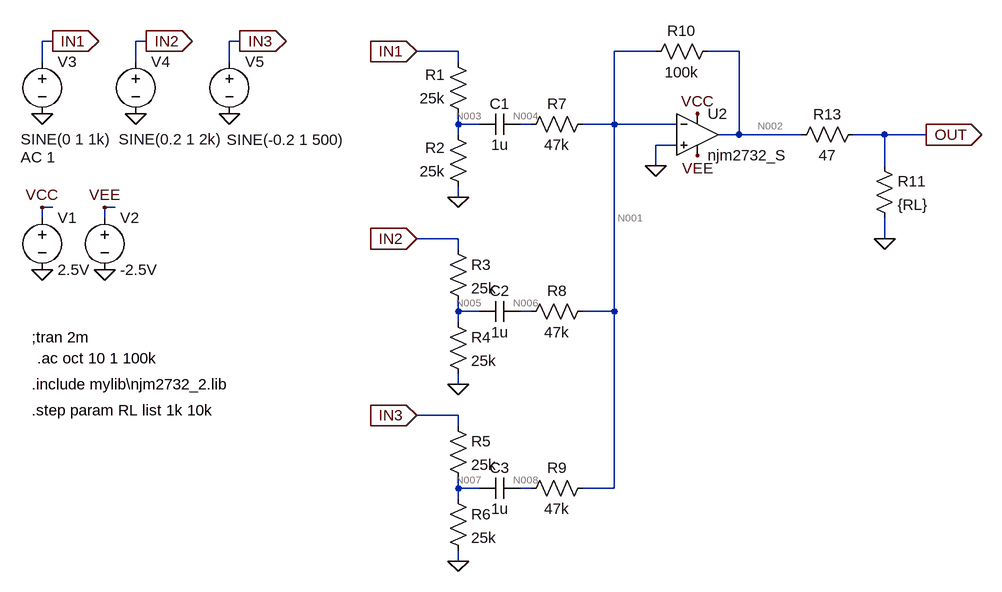
[diagram p0: schematic mini_mixer-04.asc]
mini_mixer-04.asc, the LTspice schematic file:
Version 4
SHEET 1 996 840
WIRE -656 0 -672 0
WIRE -512 0 -528 0
WIRE -368 0 -384 0
WIRE -32 16 -96 16
WIRE 272 16 208 16
WIRE 400 16 352 16
WIRE -672 32 -672 0
WIRE -528 32 -528 0
WIRE -384 32 -384 0
WIRE -32 32 -32 16
WIRE -32 128 -32 112
WIRE 0 128 -32 128
WIRE 80 128 64 128
WIRE 208 128 208 16
WIRE 208 128 160 128
WIRE 304 128 208 128
WIRE -32 144 -32 128
WIRE 400 144 400 16
WIRE 400 144 368 144
WIRE 496 144 400 144
WIRE 624 144 576 144
WIRE 688 144 624 144
WIRE 304 160 272 160
WIRE 272 192 272 160
WIRE 624 192 624 144
WIRE -32 240 -32 224
WIRE -656 256 -672 256
WIRE -560 256 -576 256
WIRE -672 272 -672 256
WIRE -576 272 -576 256
WIRE -32 304 -96 304
WIRE 624 304 624 272
WIRE -32 320 -32 304
WIRE -32 416 -32 400
WIRE 0 416 -32 416
WIRE 80 416 64 416
WIRE 208 416 208 128
WIRE 208 416 160 416
WIRE -32 432 -32 416
WIRE -32 528 -32 512
WIRE -32 576 -96 576
WIRE -32 592 -32 576
WIRE -32 688 -32 672
WIRE 0 688 -32 688
WIRE 80 688 64 688
WIRE 208 688 208 416
WIRE 208 688 160 688
WIRE -32 704 -32 688
WIRE -32 800 -32 784
FLAG -96 16 IN1
IOPIN -96 16 In
FLAG -96 304 IN2
IOPIN -96 304 In
FLAG -96 576 IN3
IOPIN -96 576 In
FLAG -32 240 0
FLAG -32 528 0
FLAG -32 800 0
FLAG 272 192 0
FLAG 688 144 OUT
IOPIN 688 144 Out
FLAG 336 112 VCC
FLAG 336 176 VEE
FLAG -672 352 0
FLAG -576 352 0
FLAG -672 256 VCC
FLAG -576 256 VEE
FLAG -656 0 IN1
IOPIN -656 0 Out
FLAG -512 0 IN2
IOPIN -512 0 Out
FLAG -368 0 IN3
IOPIN -368 0 Out
FLAG -672 112 0
FLAG -528 112 0
FLAG -384 112 0
FLAG 624 304 0
SYMBOL res -16 128 R180
WINDOW 0 36 76 Left 2
WINDOW 3 36 40 Left 2
SYMATTR InstName R1
SYMATTR Value 25k
SYMBOL res -16 240 R180
WINDOW 0 36 76 Left 2
WINDOW 3 36 40 Left 2
SYMATTR InstName R2
SYMATTR Value 25k
SYMBOL cap 64 112 R90
WINDOW 0 0 32 VBottom 2
WINDOW 3 32 32 VTop 2
SYMATTR InstName C1
SYMATTR Value 1u
SYMBOL res -48 304 R0
SYMATTR InstName R3
SYMATTR Value 25k
SYMBOL res -48 416 R0
SYMATTR InstName R4
SYMATTR Value 25k
SYMBOL cap 64 400 R90
WINDOW 0 0 32 VBottom 2
WINDOW 3 32 32 VTop 2
SYMATTR InstName C2
SYMATTR Value 1u
SYMBOL res -48 576 R0
SYMATTR InstName R5
SYMATTR Value 25k
SYMBOL res -48 688 R0
SYMATTR InstName R6
SYMATTR Value 25k
SYMBOL cap 64 672 R90
WINDOW 0 0 32 VBottom 2
WINDOW 3 32 32 VTop 2
SYMATTR InstName C3
SYMATTR Value 1u
SYMBOL res 176 112 R90
WINDOW 0 0 56 VBottom 2
WINDOW 3 32 56 VTop 2
SYMATTR InstName R7
SYMATTR Value 47k
SYMBOL res 176 400 R90
WINDOW 0 0 56 VBottom 2
WINDOW 3 32 56 VTop 2
SYMATTR InstName R8
SYMATTR Value 47k
SYMBOL res 176 672 R90
WINDOW 0 0 56 VBottom 2
WINDOW 3 32 56 VTop 2
SYMATTR InstName R9
SYMATTR Value 47k
SYMBOL res 368 0 R90
WINDOW 0 0 56 VBottom 2
WINDOW 3 32 56 VTop 2
SYMATTR InstName R10
SYMATTR Value 100k
SYMBOL voltage -672 256 R0
WINDOW 123 0 0 Left 2
WINDOW 39 0 0 Left 2
SYMATTR InstName V1
SYMATTR Value 2.5V
SYMBOL voltage -576 256 R0
WINDOW 123 0 0 Left 2
WINDOW 39 0 0 Left 2
SYMATTR InstName V2
SYMATTR Value -2.5V
SYMBOL voltage -672 16 R0
WINDOW 3 -33 135 Left 2
WINDOW 123 -33 163 Left 2
WINDOW 39 0 0 Left 2
SYMATTR Value SINE(0 1 1k)
SYMATTR Value2 AC 1
SYMATTR InstName V3
SYMBOL voltage -528 16 R0
WINDOW 3 -26 135 Left 2
WINDOW 123 0 0 Left 2
WINDOW 39 0 0 Left 2
SYMATTR Value SINE(0.2 1 2k)
SYMATTR InstName V4
SYMBOL voltage -384 16 R0
WINDOW 3 -4 136 Left 2
WINDOW 123 0 0 Left 2
WINDOW 39 0 0 Left 2
SYMATTR Value SINE(-0.2 1 500)
SYMATTR InstName V5
SYMBOL res 592 128 R90
WINDOW 0 0 56 VBottom 2
WINDOW 3 32 56 VTop 2
SYMATTR InstName R13
SYMATTR Value 47
SYMBOL res 608 176 R0
SYMATTR InstName R11
SYMATTR Value {RL}
SYMBOL Opamps\\opamp2 336 80 R0
SYMATTR InstName U2
SYMATTR Value njm2732_S
TEXT -688 456 Left 2 !;tran 2m
TEXT -680 488 Left 2 !.ac oct 10 1 100k
TEXT -688 528 Left 2 !.include mylib\\njm2732_2.lib
TEXT -688 568 Left 2 !.step param RL list 1k 10k

The netlist it stands for:
* mini_mixer-04.asc
R1 N003 IN1 25k
R2 0 N003 25k
C1 N004 N003 1u
R3 IN2 N005 25k
R4 N005 0 25k
C2 N006 N005 1u
R5 IN3 N007 25k
R6 N007 0 25k
C3 N008 N007 1u
R7 N001 N004 47k
R8 N001 N006 47k
R9 N001 N008 47k
R10 N002 N001 100k
V1 VCC 0 2.5V
V2 VEE 0 -2.5V
V3 IN1 0 SINE(0 1 1k) AC 1
V4 IN2 0 SINE(0.2 1 2k)
V5 IN3 0 SINE(-0.2 1 500)
R13 OUT N002 47
R11 OUT 0 {RL}
XU2 0 N001 VCC VEE N002 njm2732_S  ; pins In+ In- V+ V- OUT
;tran 2m
.ac oct 10 1 100k
.include mylib\njm2732_2.lib
.step param RL list 1k 10k
.backanno
.end

* Results of the author's LTspice run, read from the files saved beside the schematic
* Operating Point (first step), zero values left out:
*   rl = 1 k
*   V(n004) = -1.776 mV
*   V(in2) = 200 mV
*   V(n005) = 100 mV
*   V(n006) = -1.776 mV
*   V(in3) = -200 mV
*   V(n007) = -100 mV
*   V(n008) = -1.776 mV
*   V(n001) = -1.776 mV
*   V(n002) = -7.137 mV
*   V(vcc) = 2.5 V
*   V(vee) = -2.5 V
*   V(out) = -6.816 mV
*   I(R11) = -6.816 µA
*   I(R13) = 6.816 µA
*   I(R10) = -53.6 nA
*   I(R6) = -4 µA
*   I(R5) = -4 µA
*   I(R4) = 4 µA
*   I(R3) = 4 µA
*   I(V5) = 4 µA
*   I(V4) = -4 µA
*   I(V2) = 100 mA
*   I(V1) = -100 mA
*   Ix(u2:1) = -45.52 nA
*   Ix(u2:2) = -53.6 nA
*   Ix(u2:3) = 100 mA
*   Ix(u2:4) = -100 mA
*   Ix(u2:5) = 6.87 µA
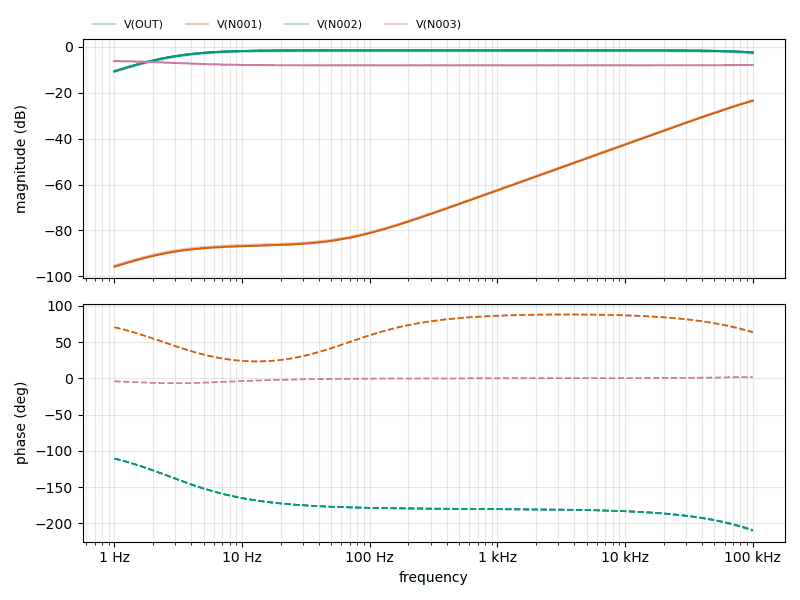
[diagram p1: AC Analysis of mini_mixer-04.asc, plotted from the saved traces]
* AC Analysis, 2 runs:
*   V(OUT) [run 1]: -11.02 dB at 1 Hz, -2.93 dB at 100 kHz, peak -1.91 dB at 724.1 Hz, 3 dB below the peak at 2.675 Hz
*   V(OUT) [run 2]: -10.67 dB at 1 Hz, -2.49 dB at 100 kHz, peak -1.55 dB at 724.1 Hz, 3 dB below the peak at 2.675 Hz
*   V(N001) [run 1]: -95.24 dB at 1 Hz, -23.22 dB at 100 kHz, peak -23.22 dB at 100 kHz, 3 dB below the peak at 66.53 kHz
*   V(N001) [run 2]: -95.78 dB at 1 Hz, -23.50 dB at 100 kHz, peak -23.50 dB at 100 kHz, 3 dB below the peak at 66.87 kHz
*   V(N002) [run 1]: -10.63 dB at 1 Hz, -2.53 dB at 100 kHz, peak -1.51 dB at 724.1 Hz, 3 dB below the peak at 2.675 Hz
*   V(N002) [run 2]: -10.63 dB at 1 Hz, -2.45 dB at 100 kHz, peak -1.51 dB at 724.1 Hz, 3 dB below the peak at 2.675 Hz
*   V(N003) [run 1]: -6.23 dB at 1 Hz, -7.92 dB at 100 kHz, peak -6.23 dB at 1 Hz
*   V(N003) [run 2]: -6.23 dB at 1 Hz, -7.93 dB at 100 kHz, peak -6.23 dB at 1 Hz